# EAGLE design analog (EAGLE 6.3)
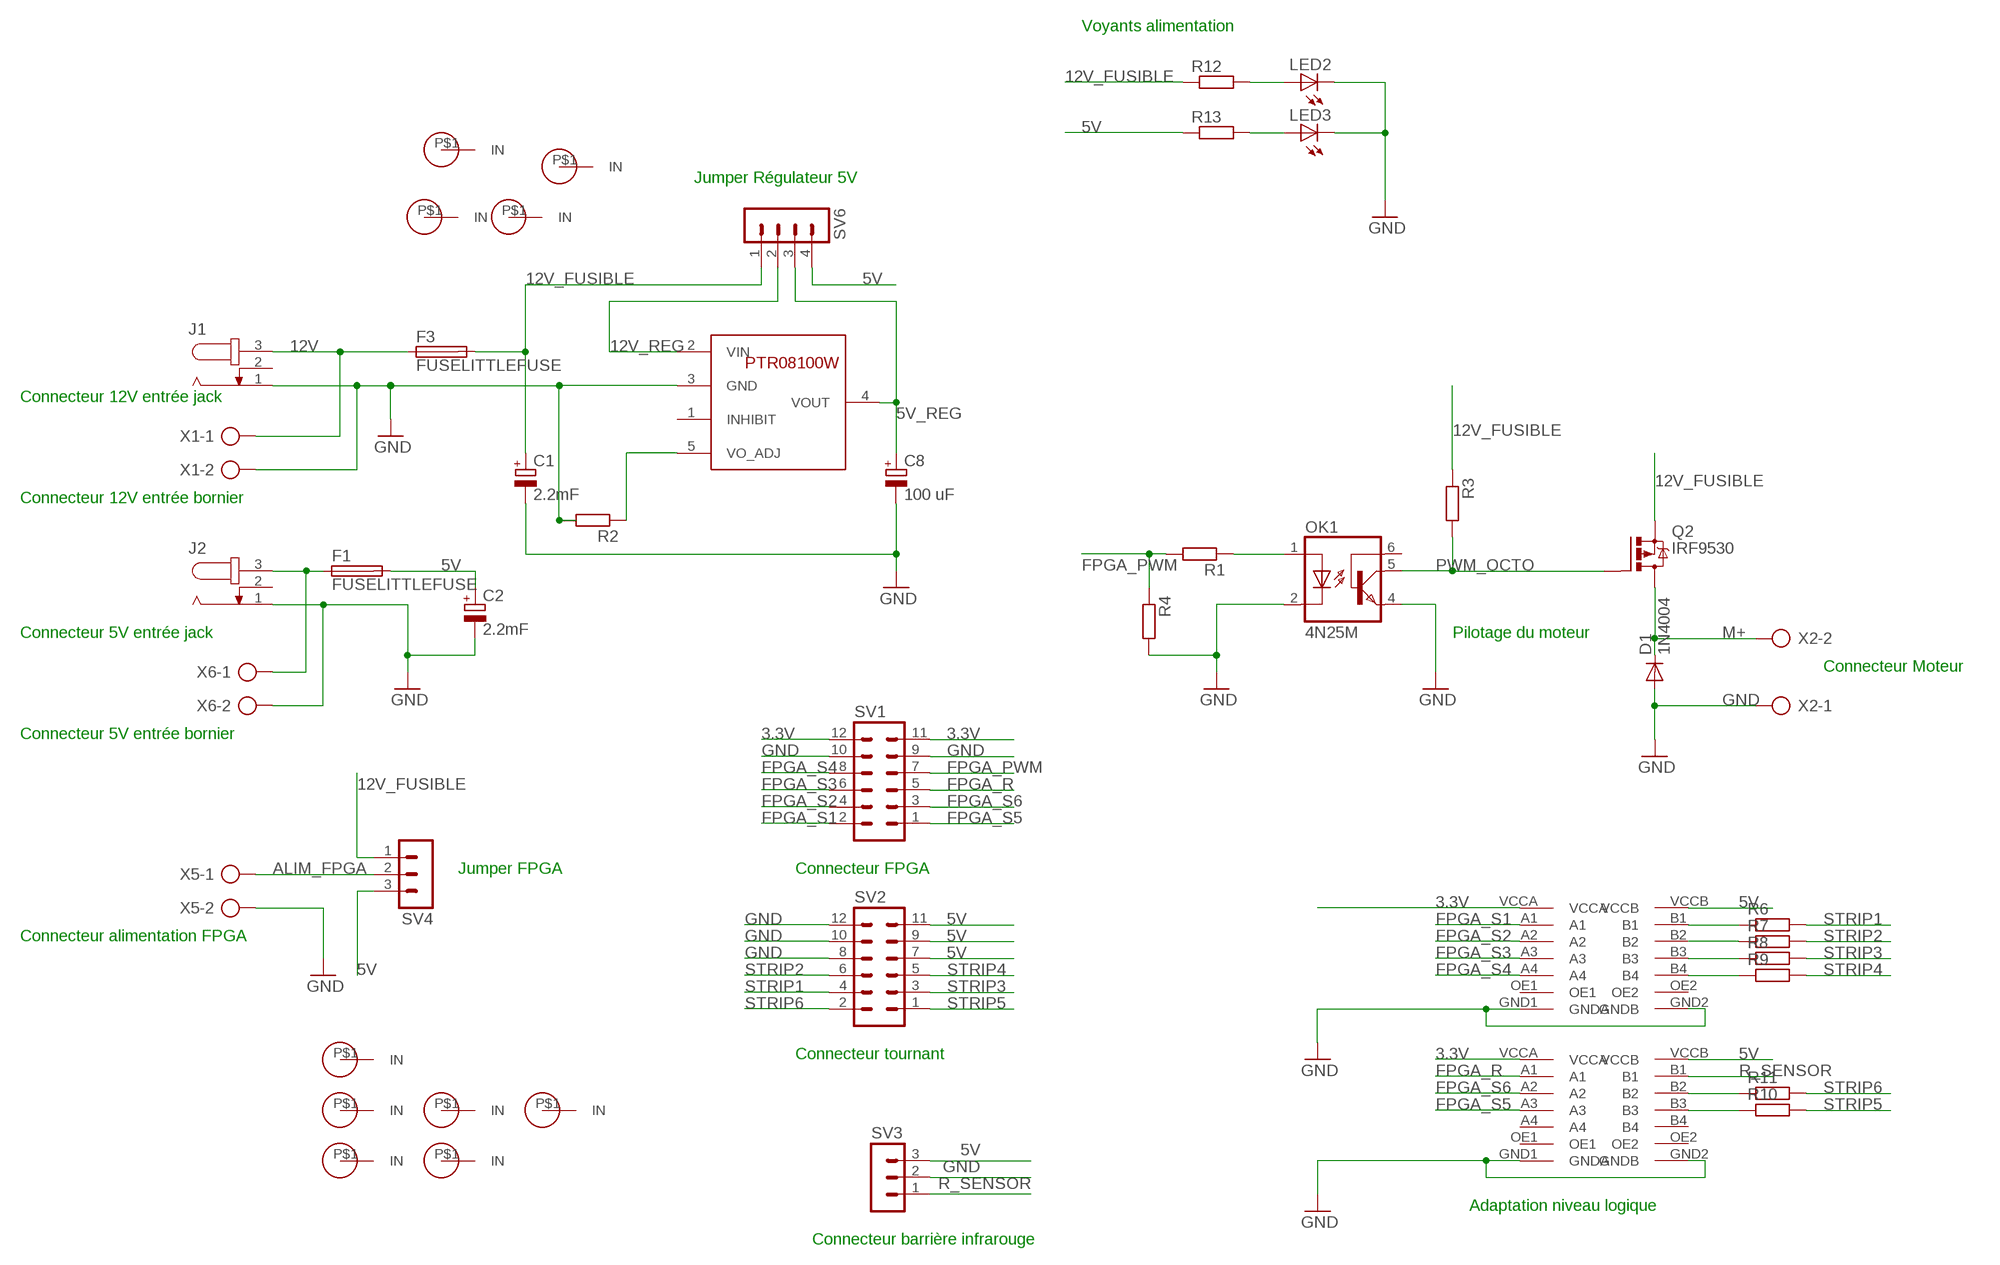
[diagram p0: schematic, sheet 1]

## Parts
C1  2.2mF  CPOL-EUE7.5-16  [E7,5-16]
C2  2.2mF  CPOL-EUE7.5-16  [E7,5-16]
C8  100 uF  CPOL-EUE2.5-7  [E2,5-7]
D1  1N4004  [DO41-10]
F1  FUSELITTLEFUSE  [LITTLEFUSE]
F3  FUSELITTLEFUSE  [LITTLEFUSE]
J1  JACK-PLUG1  [SPC4078]
J2  JACK-PLUG1  [SPC4078]
LED2  LED5MM  [LED5MM]
LED3  LED5MM  [LED5MM]
OK1  4N25M  [DIL06]
Q2  IRF9530  [TO220BV]
R1  R-EU_0207/10  [0207/10]
R2  R-EU_0207/10  [0207/10]
R3  R-EU_0207/10  [0207/10]
R4  R-EU_0207/10  [0207/10]
R6  R-EU_0207/10  [0207/10]
R7  R-EU_0207/10  [0207/10]
R8  R-EU_0207/10  [0207/10]
R9  R-EU_0207/10  [0207/10]
R10  R-EU_0207/10  [0207/10]
R11  R-EU_0207/10  [0207/10]
R12  R-EU_0207/10  [0207/10]
R13  R-EU_0207/10  [0207/10]
SV1  MA06-2  [MA06-2]
SV2  MA06-2  [MA06-2]
SV3  MA03-1  [MA03-1]
SV4  MA03-1  [MA03-1]
SV6  MA04-1  [MA04-1]
U2  PTR08100W  [PTR08100W]
U$1  TXB0104  [TXB0104]
U$2  TXB0104  [TXB0104]
U$3  JUMPER_CONNECTOR  [JUMPER_CONNECTOR]
U$4  JUMPER_CONNECTOR  [JUMPER_CONNECTOR]
U$5  JUMPER_CONNECTOR  [JUMPER_CONNECTOR]
U$6  JUMPER_CONNECTOR  [JUMPER_CONNECTOR]
U$7  JUMPER_CONNECTOR  [JUMPER_CONNECTOR]
U$8  JUMPER_CONNECTOR  [JUMPER_CONNECTOR]
U$9  JUMPER_CONNECTOR  [JUMPER_CONNECTOR]
U$10  JUMPER_CONNECTOR  [JUMPER_CONNECTOR]
U$11  JUMPER_CONNECTOR  [JUMPER_CONNECTOR]
U$12  JUMPER_CONNECTOR  [JUMPER_CONNECTOR]
X1  AK500/2  [AK500/2]
X2  AK500/2  [AK500/2]
X5  AK500/2  [AK500/2]
X6  AK500/2  [AK500/2]

## Nets
3.3V: SV1.11 SV1.12 U$1.VCCA U$2.VCCA
5V: C2.+ F1.2 R13.1 SV2.7 SV2.9 SV2.11 SV3.3 SV4.3 SV6.4 U$1.VCCB U$2.VCCB
5V_IN: F1.1 J2.3 X6.1
5V_REG: C8.+ SV6.3 U2.4(VOUT)
12V: F3.1 J1.3 X1.1
12V_FUSIBLE: C1.+ F3.2 Q2.S R3.1 R12.1 SV4.1 SV6.1
12V_REG: SV6.2 U2.2(VIN)
ALIM_FPGA: SV4.2 X5.1
FPGA_PWM: R1.2 R4.1 SV1.7
FPGA_R: SV1.5 U$2.A1
FPGA_S1: SV1.2 U$1.A1
FPGA_S2: SV1.4 U$1.A2
FPGA_S3: SV1.6 U$1.A3
FPGA_S4: SV1.8 U$1.A4
FPGA_S5: SV1.1 U$2.A3
FPGA_S6: SV1.3 U$2.A2
GND: C1.- C2.- C8.- D1.A J1.1 J2.1 LED2.K(C) LED3.K(C) OK1.2(C) OK1.4(EMI) R2.2 R4.2 SV1.9 SV1.10 SV2.8 SV2.10 SV2.12 SV3.2 U2.3(GND) U$1.GND1(GNDA) U$1.GND2(GNDB) U$2.GND1(GNDA) U$2.GND2(GNDB) X1.2 X2.1 X5.2 X6.2
M+: D1.C Q2.D X2.2
N$9: LED2.A R12.2
N$10: LED3.A R13.2
PWM_OCTO: OK1.5(COL) Q2.G R3.2
R_SENSOR: SV3.1 U$2.B1
R_STRIP_1: R6.1 U$1.B1
R_STRIP_2: R7.1 U$1.B2
R_STRIP_3: R8.1 U$1.B3
R_STRIP_4: R9.1 U$1.B4
R_STRIP_5: R10.1 U$2.B3
R_STRIP_6: R11.1 U$2.B2
RES_OCTO: OK1.1(A) R1.1
STRIP1: R6.2 SV2.4
STRIP2: R7.2 SV2.6
STRIP3: R8.2 SV2.3
STRIP4: R9.2 SV2.5
STRIP5: R10.2 SV2.1
STRIP6: R11.2 SV2.2
VO_ADJ: R2.1 U2.5(VO_ADJ)
Unconnected: J1.2 J2.2 OK1.6(BAS) U2.1(INHIBIT) U$1.OE1 U$1.OE2 U$2.A4 U$2.B4 U$2.OE1 U$2.OE2 U$3.P$1(IN) U$4.P$1(IN) U$5.P$1(IN) U$6.P$1(IN) U$7.P$1(IN) U$8.P$1(IN) U$9.P$1(IN) U$10.P$1(IN) U$11.P$1(IN) U$12.P$1(IN)

## Notes on the sheet
- Voyants alimentation
- Jumper Régulateur 5V
- Connecteur 12V entrée jack
- Connecteur 12V entrée bornier
- Connecteur 5V entrée jack | Pilotage du moteur
- Connecteur Moteur
- Connecteur 5V entrée bornier
- Jumper FPGA | Connecteur FPGA
- Connecteur alimentation FPGA
- Connecteur tournant
- Adaptation niveau logique
- Connecteur barrière infrarouge

## Library data of the parts
C1 C2 C8 = rcl:CPOL-EU: POLARIZED CAPACITOR, European symbol
D1 = diode:1N4004: DIODE general purpose rectifier, 1 A
F1 F3 = fuse:FUSE: Fuse; OC_FARNELL: unknown; OC_NEWARK: unknown
J1 J2 = con-jack:JACK-PLUG: DC POWER JACK Power Jack, DC, Right Angle, Through Hole, Rated 5A at 16VDC, PC Terminals Distributor: Farnell (www.Farnell.de) Drawing: 84N1161.pdf / 84N1162.pdf Manufacturer: SPC Technology (www.spctechnology.com) Type: SPC4077 / SPC 4078; OC_FARNELL: unknown; OC_NEWARK: unknown
LED2 LED3 = led:LED: LED OSRAM: - CHIPLED LG R971, LG N971, LY N971, LG Q971, LY Q971, LO R971, LY R971 LH N974, LH R974 LS Q976, LO Q976, LY Q976 LO Q996 - Hyper CHIPLED LW Q18S LB Q993, LB Q99A, LB R99A - SideLED LS A670, LO A670, LY A670, LG A670, LP A670 LB A673, LV A673, LT A673, LW A673 LH A674 LY A675 LS A676, LA A676, LO A676, LY A676, LW A676 LS A679, LY A679, LG A679 - Hyper Micro SIDELED® LS Y876, LA Y876, LO Y876, LY Y876 LT Y87S - SmartLED LW L88C, LW L88S LB L89C, LB L89S, LG L890 LS L89K, LO L89K, LY L89K LS L896, LA L896, LO L896, LY L896 - TOPLED LS T670, LO T670, LY T670, LG T670, LP T670 LSG T670, LSP T670, LSY T670, LOP T670, LYG T670 LG T671, LOG T671, LSG T671 LB T673, LV T673, LT T673, LW T673 LH T674 LS T676, LA T676, LO T676, LY T676, LB T676, LH T676, LSB T676, LW T676 LB T67C, LV T67C, LT T67C, LS T67K, LO T67K, LY T67K, LW E67C LS E67B, LA E67B, LO E67B, LY E67B, LB E67C, LV E67C, LT E67C LW T67C LS T679, LY T679, LG T679 LS T770, LO T770, LY T770, LG T770, LP T770 LB T773, LV T773, LT T773, LW T773 LH T774 LS E675, LA E675, LY E675, LS T675 LS T776, LA T776, LO T776, LY T776, LB T776 LHGB T686 LT T68C, LB T68C - Hyper Mini TOPLED® LB M676 - Mini TOPLED Santana® LG M470 LS M47K, LO M47K, LY M47K Source: http://www.osram.convergy.de LUXEON: - LUMILED® LXK2-PW12-R00, LXK2-PW12-S00, LXK2-PW14-U00, LXK2-PW14-V00 LXK2-PM12-R00, LXK2-PM12-S00, LXK2-PM14-U00 LXK2-PE12-Q00, LXK2-PE12-R00, LXK2-PE12-S00, LXK2-PE14-T00, LXK2-PE14-U00 LXK2-PB12-K00, LXK2-PB12-L00, LXK2-PB12-M00, LXK2-PB14-N00, LXK2-PB14-P00, LXK2-PB14-Q00 LXK2-PR12-L00, LXK2-PR12-M00, LXK2-PR14-Q00, LXK2-PR14-R00 LXK2-PD12-Q00, LXK2-PD12-R00, LXK2-PD12-S00 LXK2-PH12-R00, LXK2-PH12-S00 LXK2-PL12-P00, LXK2-PL12-Q00, LXK2-PL12-R00 Source: www.luxeon.com KINGBRIGHT: KA-3528ASYC Source: www.kingbright.com
OK1 = optocoupler:4N*?M: General Purpose 6-Pin Phototransistor Optocouplers Source: http://www.fairchildsemi.com/ds/4N/4N35-M.pdf; MPN: 4N25-M; OC_FARNELL: 1021349; OC_NEWARK: 98K9084
Q2 = transistor-power:IRF9530: P-CHANNEL HEXFET POWER-MOS-FET Source: http://www.irf.com/product-info/datasheets/data/irf9530.pdf
R1-R4 R6-R13 = rcl:R-EU_: RESISTOR, European symbol
SV1 SV2 = con-lstb:MA06-2: PIN HEADER; OC_FARNELL: unknown; OC_NEWARK: unknown
SV3 SV4 = con-lstb:MA03-1: PIN HEADER; OC_FARNELL: unknown; OC_NEWARK: unknown
SV6 = con-lstb:MA04-1: PIN HEADER; OC_FARNELL: unknown; OC_NEWARK: unknown
U2 = perso:PTR08100W
U$1 U$2 = perso:TXB0104
U$3-U$12 = perso:JUMPER_CONNECTOR
X1 X2 X5 X6 = con-ptr500:AK500/2: CONNECTOR; OC_FARNELL: unknown; OC_NEWARK: unknown

## Board
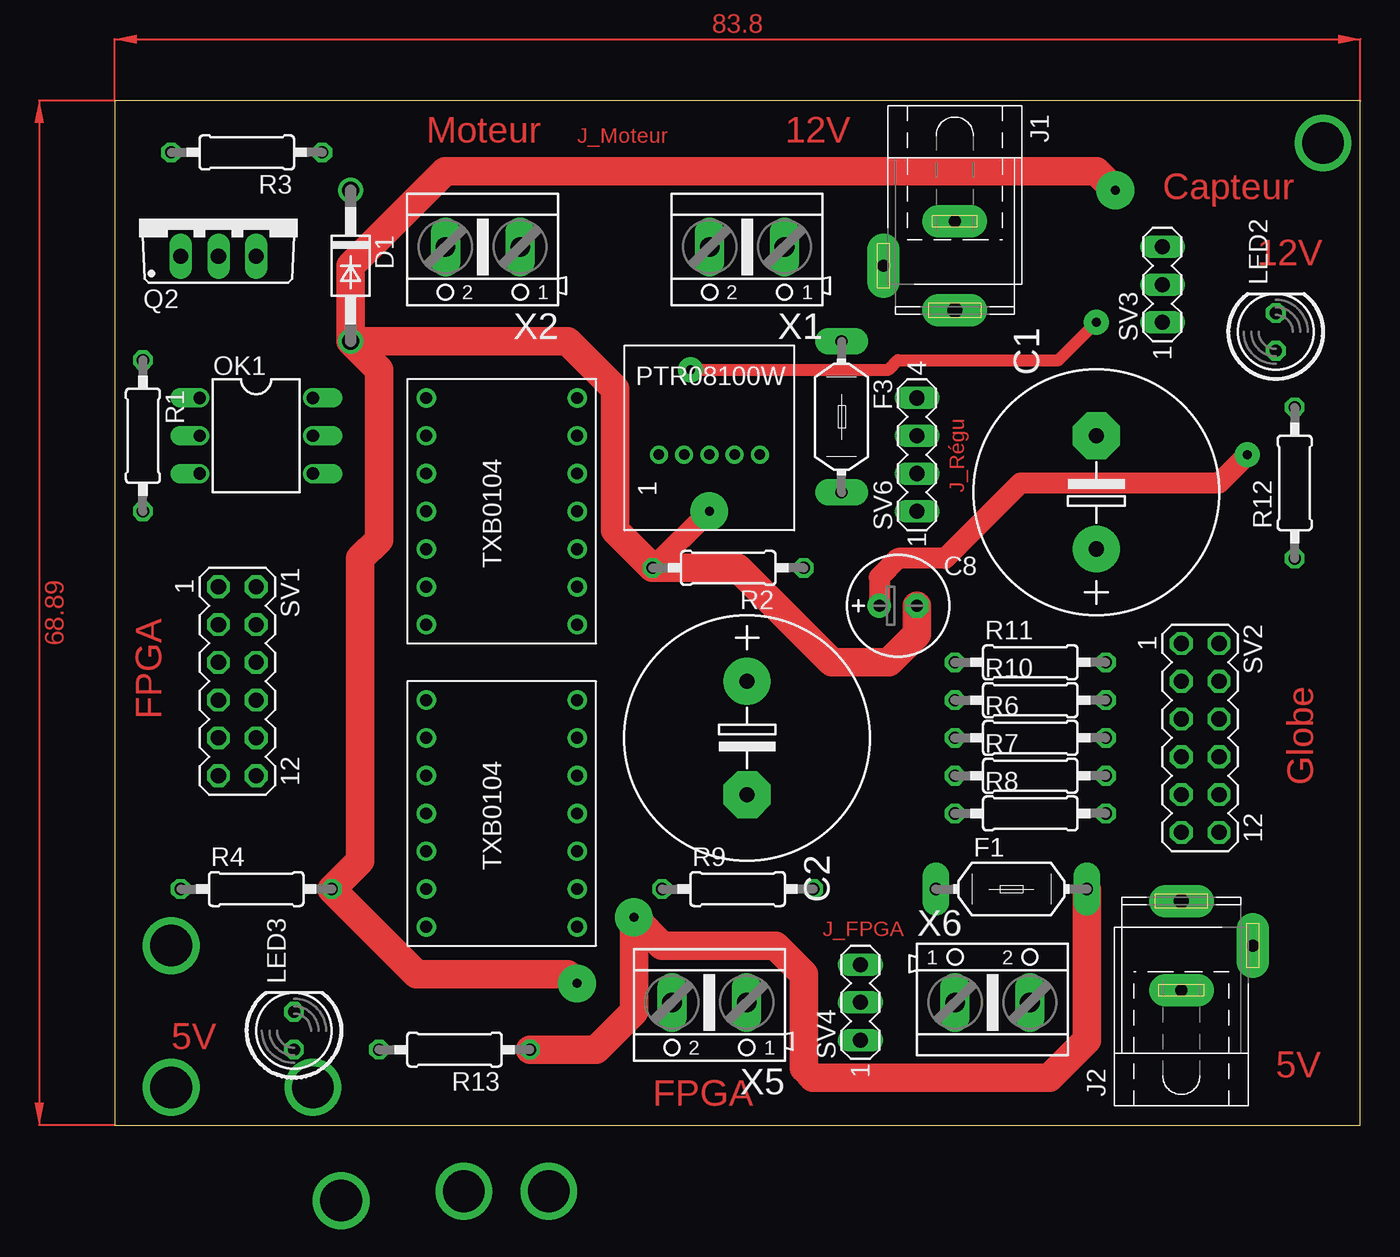
[diagram p1: board, top side]
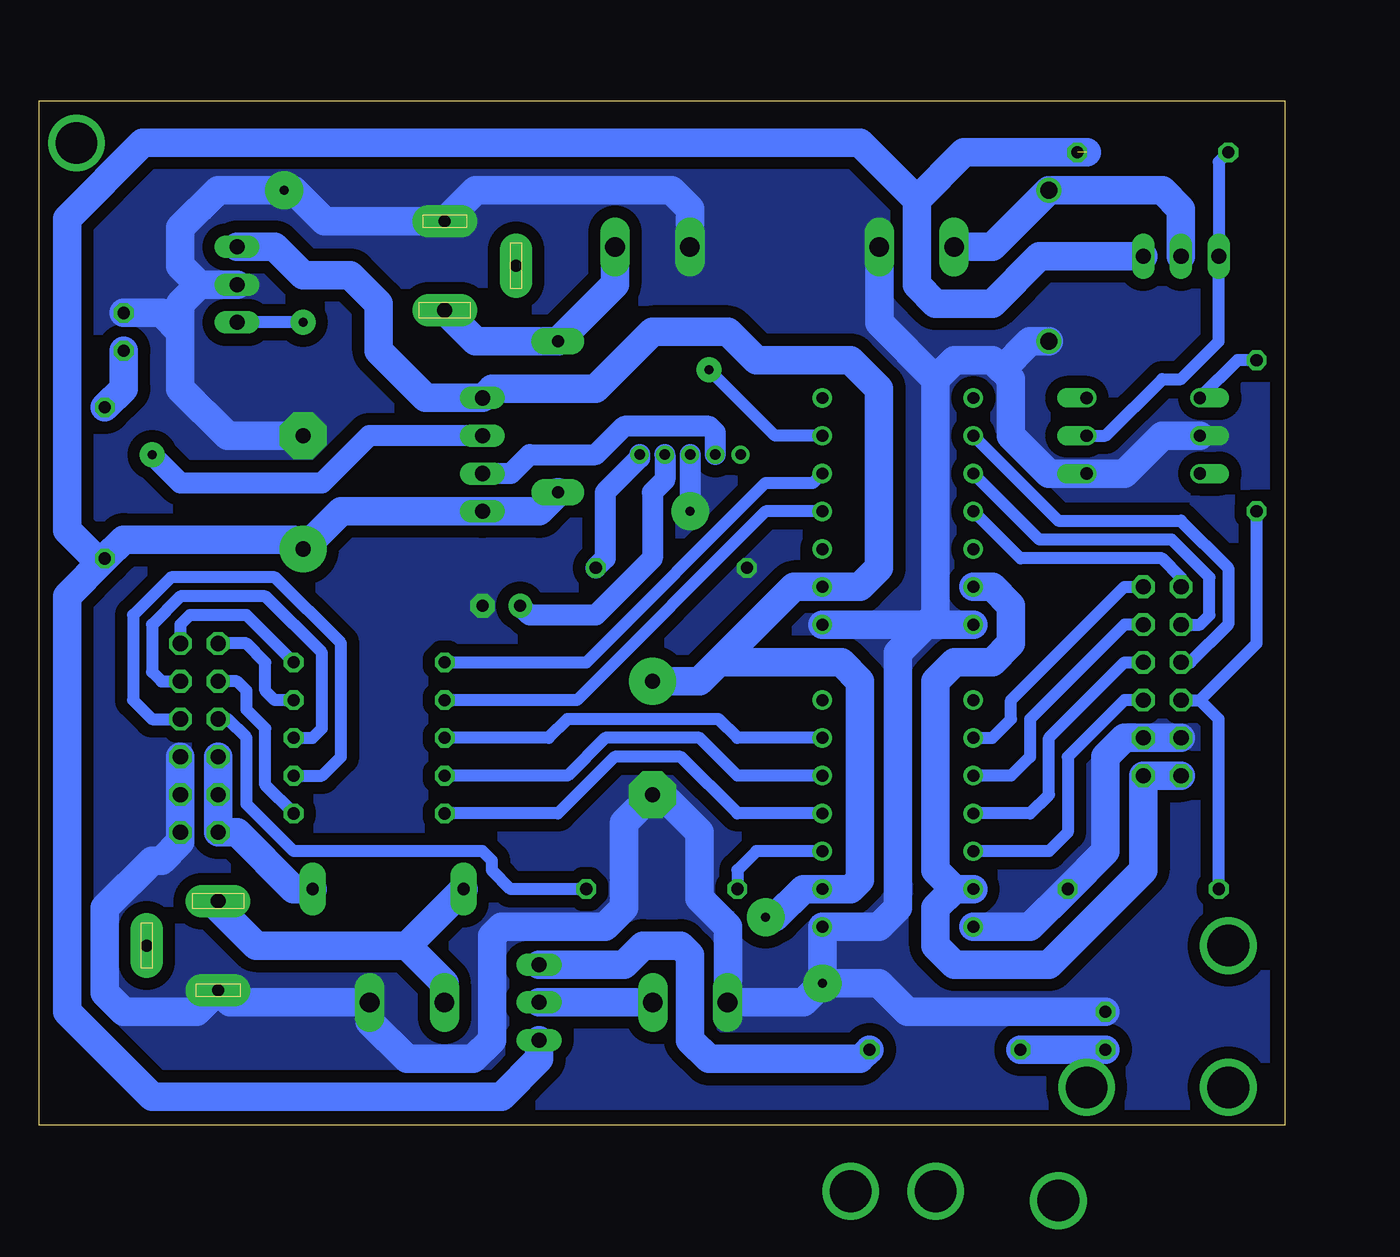
[diagram p2: board, bottom side, seen from below]

Size 83.8 x 68.89 mm. Coordinates in mm from the lower left corner, seen from the top.
Outline: 0,0 83.8,0 83.8,68.89 0,68.89 0,0
Copper layers (1*16): Top 0.035mm / dielectric 1.5mm / Bottom 0.035mm
Design rules "default": minimum track width 10mil, minimum drill 24mil, track to track 8mil, track to pad 8mil, pad to pad 8mil, via to via 8mil, smd to smd 8mil, copper to edge 40mil, drill to drill 8mil, minimum pad ring 10mil, minimum via ring 8mil, stop-mask expansion 4mil, vias tented up to drill 0mil, thermal gap 10mil

### Footprints (pad centres in the part's own frame; a part is rotated, then mirrored left to right if it is on the bottom)
E7,5-16 = drill 1.016 pad 3.15: + -3.81,0 | drill 1.016 pad 3.15 octagon: - 3.81,0
E2,5-7 = drill 0.813 pad 1.6: + -1.27,0 | drill 0.813 pad 1.6 octagon: - 1.27,0
DO41-10 = drill 1.118: A 5.08,0; C -5.08,0
LITTLEFUSE = drill 0.813 pad 1.778 long: 1 -5.08,0; 2 5.08,0
SPC4078 = drill 0.8 pad 2.184 long: 1 -3,0; 2 0,-4.8 | drill 1 pad 2.184 long: 3 3,0
LED5MM = drill 0.813 octagon: A -1.27,0; K 1.27,0
DIL06 = drill 0.813 offset: 1 -2.54,-3.81; 2 0,-3.81; 3 2.54,-3.81; 4 2.54,3.81; 5 0,3.81; 6 -2.54,3.81
TO220BV = drill 1.016 long: D 0,-2.54; G -2.54,-2.54; S 2.54,-2.54
0207/10 = drill 0.813 octagon: 1 -5.08,0; 2 5.08,0
MA06-2 = drill 1.016 octagon: 1 -6.35,-1.27; 2 -6.35,1.27; 3 -3.81,-1.27; 4 -3.81,1.27; 5 -1.27,-1.27; 6 -1.27,1.27; 7 1.27,-1.27; 8 1.27,1.27; 9 3.81,-1.27; 10 3.81,1.27; 11 6.35,-1.27; 12 6.35,1.27
MA03-1 = drill 1.016 long: 1 -2.54,0; 2 0,0; 3 2.54,0
MA04-1 = drill 1.016 long: 1 -3.81,0; 2 -1.27,0; 3 1.27,0; 4 3.81,0
PTR08100W = drill 0.7: 1 0,-3.4; 2 0,-1.7; 3 0,0; 4 0,1.7; 5 0,3.4
TXB0104 = drill 0.8: A1 -5.08,5.08; A2 -5.08,2.54; A3 -5.08,0; A4 -5.08,-2.54; B1 5.08,5.08; B2 5.08,2.54; B3 5.08,0; B4 5.08,-2.54; GND1 -5.08,-7.62; GND2 5.08,-7.62; OE1 -5.08,7.62; OE2 5.08,7.62; VCCA -5.08,-5.08; VCCB 5.08,-5.08
JUMPER_CONNECTOR = drill 2.8 pad 3.81: P$1 0,0
AK500/2 = drill 1.321 long: 1 -2.515,0; 2 2.515,0

### Placement (x,y rotation side)
C1  66.04,42.55 90 top
C2  42.55,26.04 270 top
C8  52.7,34.93 0 top
D1  15.88,57.79 270 top
F1  60.32,15.88 0 top
F3  48.89,47.62 270 top
J1  56.52,57.79 270 top
J2  71.75,12.06 90 top
LED2  78.11,53.34 90 top
LED3  12.07,6.35 90 top
OK1  9.53,46.36 270 top
Q2  6.99,60.96 0 top
R1  1.91,46.36 270 top
R2  41.27,37.47 180 top
R3  8.89,65.41 180 top
R4  9.53,15.88 0 top
R6  61.59,26.04 0 top
R7  61.59,23.5 0 top
R8  61.59,20.96 0 top
R9  41.91,15.88 0 top
R10  61.59,28.58 0 top
R11  61.59,31.12 0 top
R12  79.38,43.18 90 top
R13  22.86,5.08 180 top
SV1  8.26,29.85 270 top
SV2  73.03,26.04 270 top
SV3  70.48,56.52 90 top
SV4  50.16,8.25 90 top
SV6  53.98,45.09 90 top
U2  40,45.09 270 top
U$1  26.04,20.96 0 top
U$2  26.04,41.27 0 top
U$3  3.81,2.54 0 top
U$4  3.81,12.06 0 top
U$5  13.34,2.54 0 top
U$6  81.28,66.04 0 top
U$7  94.61,55.25 0 top  (outside the outline)
U$8  29.21,-4.44 0 top  (outside the outline)
U$9  23.49,-4.44 0 top  (outside the outline)
U$10  92.71,61.59 0 top  (outside the outline)
U$11  15.24,-5.08 0 top  (outside the outline)
U$12  88.9,66.04 0 top  (outside the outline)
X1  42.55,59.05 180 top
X2  24.77,59.05 180 top
X5  40,8.25 180 top
X6  59.05,8.25 0 top

### Tracks (layer width: path | path; a pad name or v marks a point on that pad's centre or on a via)
3.3V
  Bottom 1.93: SV1.11 SV1.12 9.53,17.14 15.88,10.79 22.22,10.79 23.49,12.06 23.49,14.6 22.22,15.88 | 22.22,15.88 U$1.VCCA | U$2.VCCA 19.68,36.2 18.41,34.93 18.41,32.38 19.68,31.12 22.22,31.12 23.49,29.85 23.49,17.14 22.22,15.88
5V  (via drill 0.6 pad 2.54)
  Top 1.93: F1.2 65.41,5.71 62.86,3.17 46.99,3.17 46.35,3.81 46.35,10.16 44.45,12.06 36.83,12.06 v34.92,13.97 34.92,7.62 32.38,5.08 R13.1
  Bottom 1.93: SV3.3 67.94,59.05 66.04,57.15 62.86,57.15 60.96,55.25 60.96,52.07 57.78,48.9 SV6.4 53.34,49.53 47.62,49.53 46.99,49.53 46.35,49.53 42.55,53.34 37.46,53.34 35.56,51.44 29.21,51.44 27.3,49.53 27.3,37.47 28.57,36.2 U$2.VCCB 33.02,36.2 38.1,31.12 | C2.+ 39.37,29.85 38.1,31.12 | SV2.7 SV2.9 SV2.11 70.48,19.69 66.67,15.88 F1.2 | SV4.3 44.45,10.79 43.18,12.06 40.64,12.06 40,11.43 40,5.71 38.73,4.45 28.57,4.45 R13.1 | v34.92,13.97 34.29,13.97 32.38,15.88 U$1.VCCB 29.21,15.88 28.57,16.51 28.57,29.85 29.84,31.12 38.1,31.12
5V_IN
  Bottom 1.93: J2.3 71.75,14.6 69.22,12.06 59.05,12.06 | 59.05,12.06 F1.1 | X6.1 56.54,9.55 59.05,12.06
5V_REG  (via drill 0.6 pad 1.68)
  Top 1.422: C8.+ 51.44,36.83 52.7,38.1 55.88,38.1 60.96,43.18 74.3,43.18 v76.2,45.09
  Bottom 1.422: U2.4 41.7,43.38 42.55,42.55 42.55,38.1 46.35,34.29 50.8,34.29 C8.+ | SV6.3 61.59,46.36 64.45,43.5 64.77,43.18 74.3,43.18 v76.2,45.09
12V
  Bottom 1.93: X1.1 45.06,56.54 F3.1 54.44,52.7 J1.3
12V_FUSIBLE  (1 unrouted)
  Bottom 1.93: F3.2 50.16,41.27 SV6.1 63.5,41.27 C1.+ 66.67,39.37 78.11,39.37 R12.1 | SV4.1 50.16,4.45 52.7,1.91 76.2,1.91 81.91,7.62 81.91,35.56 R12.1 | R12.1 80.01,38.1 81.91,40.01 81.91,60.96 76.83,66.04 28.57,66.04 24.77,62.23 | 13.34,65.41 21.59,65.41 24.77,62.23 | Q2.S 16.51,58.42 19.68,55.25 23.49,55.25 24.77,56.52 24.77,62.23
12V_REG
  Bottom 1.422: U2.2 38.3,46.56 38.73,46.99 44.45,46.99 46.35,45.09 50.8,45.09 52.07,43.81 SV6.2
ALIM_FPGA
  Bottom 1.93: X5.1 SV4.2
FPGA_PWM
  Bottom 0.813: SV1.7 5.71,28.58 | 5.71,28.58 1.91,32.38 R1.2 | R4.1 4.44,27.3 5.71,28.58
FPGA_R
  Bottom 0.813: U$2.A1 15.24,40.64 6.99,40.64 3.81,37.47 3.81,33.66 6.35,31.12 SV1.5
FPGA_S1
  Bottom 0.813: U$1.A1 19.68,26.04 18.41,27.3 18.41,28.58 10.79,36.2 SV1.2
FPGA_S2
  Bottom 0.813: SV1.4 10.79,33.66 17.14,27.3 17.14,24.77 18.41,23.5 U$1.A2
FPGA_S3
  Bottom 0.813: SV1.6 10.79,31.12 15.88,26.04 15.88,22.23 17.14,20.96 U$1.A3
FPGA_S4
  Bottom 0.813: SV1.8 10.79,28.58 14.61,24.77 14.61,19.69 15.88,18.42 U$1.A4
FPGA_S5
  Bottom 0.813: SV1.1 6.99,36.83 8.26,38.1 17.78,38.1 U$2.A3
FPGA_S6
  Bottom 0.813: SV1.3 5.71,33.66 5.08,34.29 5.08,36.83 7.62,39.37 16.51,39.37 U$2.A2
GND  (via drill 0.6 pad 2.54)
  Top 1.422: v40,41.27 R2.2
  Top 1.93: v31.12,9.53 30.48,10.16 20.32,10.16 R4.2 16.51,17.78 16.51,38.1 17.78,39.37 17.78,50.8 D1.A | C8.- 53.98,33.02 52.07,31.12 48.26,31.12 41.91,37.47 R2.2 33.66,40.01 33.66,49.53 30.48,52.7 D1.A | D1.A 15.88,57.79 22.22,64.13 66.04,64.13 v67.31,62.87
  Bottom 1.422: U2.3 v40,41.27
  Bottom 1.93: OK1.2 8.26,46.36 10.79,43.81 OK1.4 15.88,43.81 18.41,46.36 18.41,50.16 19.05,50.8 | 19.05,50.8 19.68,51.44 22.22,51.44 23.49,50.16 | SV1.9 SV1.10 10.79,26.04 12.07,24.77 12.07,18.42 R4.2 17.14,13.33 U$1.GND1 | 22.22,33.66 U$2.GND1 24.13,33.66 | D1.A 17.14,52.7 19.05,50.8 | X2.1 27.28,53.95 23.49,50.16 | 73.03,56.52 74.3,57.79 74.3,60.33 71.75,62.87 v67.31,62.87 66.67,62.87 64.59,60.79 J1.1 54.44,62.87 41.27,62.87 40.03,61.62 X1.2 40,59.03 | SV3.2 73.03,56.52 | SV2.8 SV2.10 SV2.12 74.3,19.05 75.56,17.78 76.2,17.78 79.38,14.6 79.38,8.89 78.11,7.62 73.2,7.62 J2.1 70.94,8.25 X6.2 61.57,6.96 59.05,4.45 54.61,4.45 53.34,5.71 53.34,12.7 52.7,13.33 45.72,13.33 44.45,14.6 44.45,20.32 C2.- 41.91,22.23 39.37,19.69 39.37,15.24 37.46,13.33 37.46,8.28 X5.2 32.38,8.25 v31.12,9.53 | v31.12,9.53 U$1.GND2 27.3,13.33 26.04,14.6 26.04,31.75 24.13,33.66 | U$2.GND2 24.13,33.66 | 23.49,50.16 23.49,34.29 24.13,33.66 | C1.- 71.12,46.36 74.3,49.53 74.3,53.34 | 74.3,53.34 74.3,55.25 73.03,56.52 | LED3.K 25.4,7.62 27.3,9.53 v31.12,9.53 | LED2.K 75.56,54.61 74.3,53.34
  pour Bottom (isolate 0.813, no thermals): 0,0 0,69.22 84.45,69.22 85.09,69.22 85.09,0
M+
  Bottom 1.93: X2.2 19.68,59.05 D1.C 8.26,62.87 6.99,61.59 Q2.D
N$9
  Bottom 1.93: R12.2 78.11,49.53 LED2.A
N$10
  Bottom 1.93: LED3.A R13.2
PWM_OCTO
  Bottom 0.813: OK1.5 12.07,46.36 8.26,50.16 6.99,50.16 4.44,52.7 Q2.G 4.44,64.77 R3.2
R_SENSOR  (via drill 0.6 pad 1.68)
  Top 0.813: v38.73,50.8 52.07,50.8 52.7,51.44 63.5,51.44 v66.04,53.98
  Bottom 0.813: U$2.B1 34.29,46.36 v38.73,50.8 | v66.04,53.98 SV3.1
R_STRIP_1
  Bottom 0.813: U$1.B1 36.83,26.04 38.1,27.3 48.26,27.3 49.53,26.04 R6.1
R_STRIP_2
  Bottom 0.813: U$1.B2 36.83,23.5 39.37,26.04 45.72,26.04 48.26,23.5 R7.1
R_STRIP_3
  Bottom 0.813: U$1.B3 36.83,20.96 40.64,24.77 45.09,24.77 48.89,20.96 R8.1
R_STRIP_4
  Bottom 0.813: U$1.B4 35.56,18.42 36.83,17.14 R9.1
R_STRIP_5
  Bottom 0.813: U$2.B3 34.92,41.27 47.62,28.58 R10.1
R_STRIP_6
  Bottom 0.813: R11.1 46.99,31.12 34.92,43.18 31.75,43.18 U$2.B2
RES_OCTO
  Bottom 0.813: R1.1 3.17,51.44 OK1.1
STRIP1
  Bottom 0.813: R6.2 65.41,26.04 64.77,26.67 64.77,31.75 68.58,35.56 74.3,35.56 76.2,33.66 76.2,30.48 75.56,29.85 SV2.4
STRIP2
  Bottom 0.813: R7.2 64.77,23.5 63.5,24.77 63.5,32.38 67.94,36.83 74.93,36.83 77.47,34.29 77.47,28.58 76.2,27.3 SV2.6
STRIP3
  Bottom 0.813: R8.2 68.58,22.86 68.58,26.67 69.85,27.94 69.85,29.21 70.48,29.85 SV2.3
STRIP4
  Bottom 0.813: R9.2 52.07,15.88 53.34,17.14 53.34,17.78 53.98,18.42 66.67,18.42 69.85,21.59 69.85,26.04 71.12,27.3 SV2.5
STRIP5
  Bottom 0.813: R10.2 67.94,28.58 68.58,29.21 68.58,31.12 69.85,32.38 SV2.1
STRIP6
  Bottom 0.813: R11.2 69.85,34.29 73.66,34.29 74.3,33.66 SV2.2
VO_ADJ
  Bottom 1.422: U2.5 43.41,44.86 45.72,42.55 45.72,38.1 R2.1
(copper drawn outside any net)
  shapes: Top area x2

### Text on the board
Top: Moteur | J_Moteur | 12V | Capteur | 12V | J_Régu | FPGA | Globe | J_FPGA | 5V | 5V | FPGA